# Altium project VGA Breakout.PrjPcb
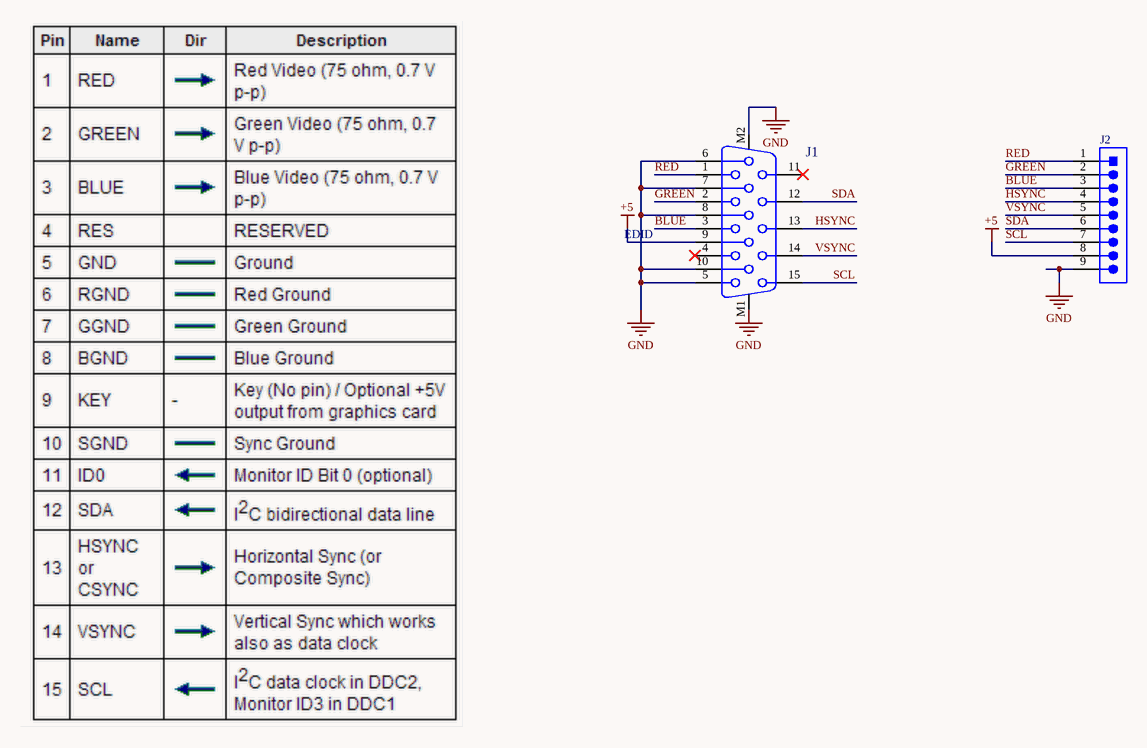
[diagram p0: VGA Breakout.SchDoc]
1 sheet, 2 parts. Net scope: flat (ports and power ports of the same name join across sheets).
Board file: VGA Breakout.PcbDoc

## Sheet VGA Breakout.SchDoc
size 279 x 215 mm; CompanyName: UVM AERO; Organization: UVM AERO; Address1: 33 Colchester Ave; Address2: Votey 118; Address3: Philadelpia, PA 19104; Address4: USA

### Parts
J1  DSUB HD DB15 HD14 FEMALE  [618015330923]  (value not drawn)
J2  9 contacts Male header  [PH1-09-UA]  (value not drawn)

### Nets
+5: J1.9 J2.8
GND: J1.5 J1.6 J1.7 J1.8 J1.10 J1.M1 J1.M2 J2.9
BLUE: J1.3 J2.3
GREEN: J1.2 J2.2
HSYNC: J1.13 J2.4
RED: J1.1 J2.1
SCL: J1.15 J2.7
SDA: J1.12 J2.6
VSYNC: J1.14 J2.5

Not connected (* = marked no-connect by the designer): J1 4* 11*

### Notes on the sheet
- (near J1) EDID
- Title:
- Desc:
- Size:
- Date:
- File:
- Repo:
- US Letter
- Auth:
- Time:
- Sheet
- Proj:
- of

### Library data of the parts
J1 = 618015330923: 15 Position D-Sub, High Density Receptacle, Female Sockets Connector; Manufacturer: Würth Elektronik; Description in Visual: Con D-Sub TH F HD15 Hor F-Jack; Jackscrew: Mating Side, Female Screwlock (4-40); Number of Contacts: 15HD; Current Rating: 3A; P/N: 618015330923; Manufacturer P/N: 618015330923; Type: WR-DSUB; Orientation: Horizontal; Mount: Through Hole, Right Angle; Gender: Female; Contact Finish: Gold; Shell Finish: Steel, Nickel Plated; PCB Package: 618015330923; ComponentLink1Description: Manufacturer Website; ComponentLink1URL: #https://www.we-online.com/web/en/wuerth_elektronik/start.php#; ComponentLink2Description: Component Datasheet; ComponentLink2URL: #https://katalog.we-online.de/em/datasheet/618015330923.pdf#; Shell Size: (DE, E) High Density
J2 = PH1-09-UA: Connector Male Header 1X9 vertical 9contacts 0.100in pitch Gold; Manufacturer: Adam Tech; PCB Package: THT 9; Description in Visual: Con Hdr Male 9contacts vertical 9x1; Number of Contacts: 9; P/N: PH1-09-UA; Manufacturer P/N: PH1-09-UA; Orientation: vertical; Number of Rows: 1; Pitch: 0.100in; Contact Finish: Gold; Gender: Male; ComponentLink1Description: Manufacturer Website; ComponentLink1URL: http://www.adam-tech.com/; ComponentLink2Description: Component Datasheet; ComponentLink2URL: http://www.adam-tech.com/downloader.php?p=PH1-XX-UA.pdf